# Altium project Non-Isolated Gate Driver and Supply.PrjPcb
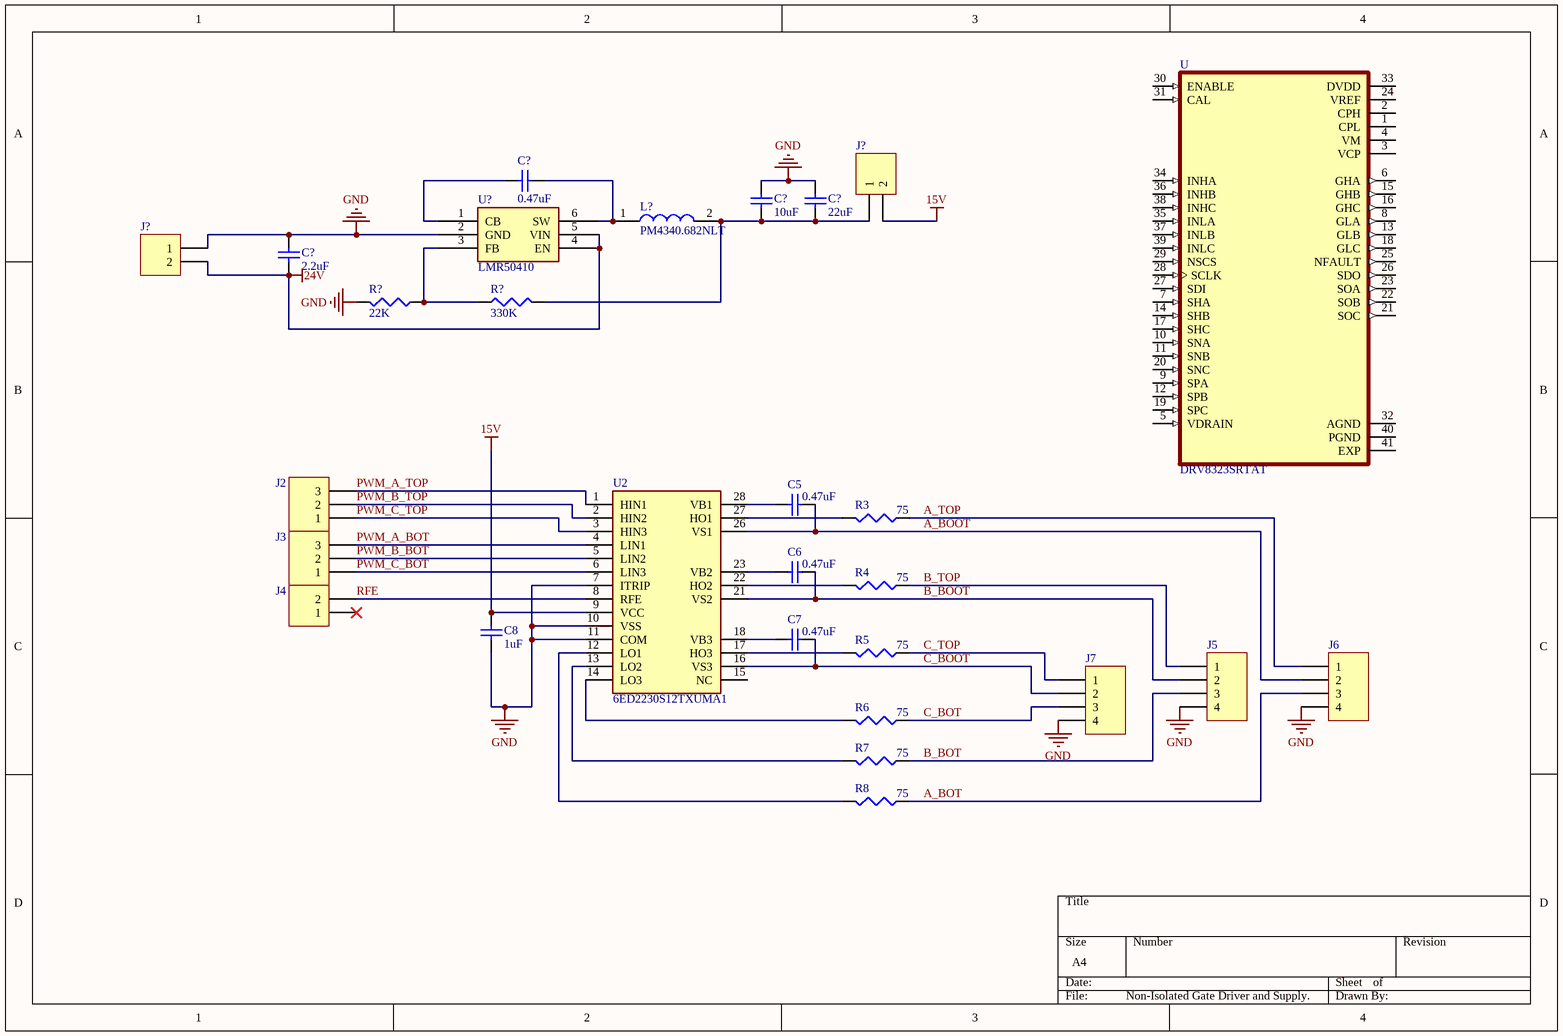
[diagram p0: Non-Isolated Gate Driver and Supply.SchDoc]
1 sheet, 28 parts. Net scope: global (net labels, ports and power ports of the same name join across sheets).
Board file: Non-Isolated Gate Driver and Supply.PcbDoc

## Sheet Non-Isolated Gate Driver and Supply.SchDoc
size A4

### Parts
(Parts that share a designator on the sheet are numbered #1, #2 ... from top to bottom, then left to right.)
C5  value 0.47uF  [C1206]  (hidden comment: Cap)
C6  value 0.47uF  [C1206]  (hidden comment: Cap)
C7  value 0.47uF  [C1206]  (hidden comment: Cap)
C8  value 1uF  [C0805]  (hidden comment: Cap)
C?#1  value 0.47uF  [C0805]  (hidden comment: Cap)
C?#2  value 10uF  [C0805]  (hidden comment: Cap)
C?#3  value 22uF  [C0805]  (hidden comment: Cap)
C?#4  value 2.2uF  [C0805]  (hidden comment: Cap)
J2  Header 3  [HDR1X3]  (value not drawn)
J3  Header 3  [HDR1X3]  (value not drawn)
J4  Header 2  [HDR1X2]  (value not drawn)
J5  Header 4  [HDR1X4]  (value not drawn)
J6  Header 4  [HDR1X4]  (value not drawn)
J7  Header 4  [HDR1X4]  (value not drawn)
J?#1  Header 2  [HDR1X2]  (value not drawn)
J?#2  Header 2  [HDR1X2]  (value not drawn)
L?  PM4340.682NLT  [PM4340682NLT]
R3  value 75  [C1206]  (hidden comment: Res3)
R4  value 75  [C1206]  (hidden comment: Res3)
R5  value 75  [C1206]  (hidden comment: Res3)
R6  value 75  [C1206]  (hidden comment: Res3)
R7  value 75  [C1206]  (hidden comment: Res3)
R8  value 75  [C1206]  (hidden comment: Res3)
R?#1  value 330K  [J1-0603]  (hidden comment: Res3)
R?#2  value 22K  [J1-0603]  (hidden comment: Res3)
U  DRV8323SRTAT  [QFN50P600X600X80-41N415X415]
U2  6ED2230S12TXUMA1  [SOIC127P1030X265-28N]
U?  LMR50410  [LMR50410]

### Nets
15V: C8.1 J?#1.2 U2.9(VCC)
24V: C?#4.2 J?#2.2 U?.4(EN) U?.5(VIN)
GND: C8.2 C?#2.1 C?#3.1 C?#4.1 J5.4 J6.4 J7.4 J?#2.1 R?#2.2 U2.7(ITRIP) U2.10(VSS) U2.11(COM) U?.2(GND)
A_BOOT: C5.1 J6.2 U2.26(VS1)
A_BOT: J6.3 R8.1
A_TOP: J6.1 R3.1
B_BOOT: C6.1 J5.2 U2.21(VS2)
B_BOT: J5.3 R7.1
B_TOP: J5.1 R4.1
C_BOOT: C7.1 J7.2 U2.16(VS3)
C_BOT: J7.3 R6.1
C_TOP: J7.1 R5.1
PWM_A_BOT: J3.3 U2.4(LIN1)
PWM_A_TOP: J2.3 U2.1(HIN1)
PWM_B_BOT: J3.2 U2.5(LIN2)
PWM_B_TOP: J2.2 U2.2(HIN2)
PWM_C_BOT: J3.1 U2.6(LIN3)
PWM_C_TOP: J2.1 U2.3(HIN3)
RFE: J4.2 U2.8(RFE)
NetC5_2: C5.2 U2.28(VB1)
NetC6_2: C6.2 U2.23(VB2)
NetC7_2: C7.2 U2.18(VB3)
NetC?#1_1: C?#1.1 U?.1(CB)
NetC?#1_2: C?#1.2 L?.1 U?.6(SW)
NetC?#2_2: C?#2.2 C?#3.2 J?#1.1 L?.2 R?#1.2
NetR3_2: R3.2 U2.27(HO1)
NetR4_2: R4.2 U2.22(HO2)
NetR5_2: R5.2 U2.17(HO3)
NetR6_2: R6.2 U2.14(LO3)
NetR7_2: R7.2 U2.13(LO2)
NetR8_2: R8.2 U2.12(LO1)
NetR?#1_1: R?#1.1 R?#2.1 U?.3(FB)

Not connected (* = marked no-connect by the designer): J4 1*; U 1(CPL) 2(CPH) 3(VCP) 4(VM) 5(VDRAIN) 6(GHA) 7(SHA) 8(GLA) 9(SPA) 10(SNA) 11(SNB) 12(SPB) 13(GLB) 14(SHB) 15(GHB) 16(GHC) 17(SHC) 18(GLC) 19(SPC) 20(SNC) 21(SOC) 22(SOB) 23(SOA) 24(VREF) 25(NFAULT) 26(SDO) 27(SDI) 28(SCLK) 29(NSCS) 30(ENABLE) 31(CAL) 32(AGND) 33(DVDD) 34(INHA) 35(INLA) 36(INHB) 37(INLB) 38(INHC) 39(INLC) 40(PGND) 41(EXP); U2 15(NC)

### Library data of the parts
C5-C8 C?#1-C?#4 = Cap: Capacitor; Published: 8-Jun-2000; LatestRevisionDate: 17-Jul-2002; LatestRevisionNote: Re-released for DXP Platform.; PackageReference: RAD-0.3; Publisher: Altium Limited; PackageDescription: Radial Cap, Thru-Hole; 2 Leads; 0.3 in Pin Spacing
J2 J3 = Header 3: Header, 3-Pin; LatestRevisionDate: 17-Jul-2002; LatestRevisionNote: Re-released for DXP Platform.; Publisher: Altium Limited
J4 J?#1 J?#2 = Header 2: Header, 2-Pin; LatestRevisionDate: 17-Jul-2002; LatestRevisionNote: Re-released for DXP Platform.; Publisher: Altium Limited
J5-J7 = Header 4: Header, 4-Pin; LatestRevisionDate: 17-Jul-2002; LatestRevisionNote: Re-released for DXP Platform.; Publisher: Altium Limited
L? = PM4340.682NLT: Inductor; Manufacturer_Name: Pulse; Datasheet Link: https://eu.mouser.com/ProductDetail/Pulse-Electronics/PM4345682NLT?qs=OTrKUuiFdkYTz4rt1sdWWw%3D%3D; Height: 2mm; Manufacturer_Part_Number: PM4340.682NLT
R3-R8 R?#1 R?#2 = Res3: Resistor; Published: 8-Jun-2000; LatestRevisionDate: 29-May-2009; LatestRevisionNote: IPC-7351 Footprint Added.; PackageReference: J1-0603; Publisher: Altium Limited; PackageDescription: Chip Resistor
U = DRV8323SRTAT: Multiphase Motor Driver Power MOSFET SPI 40-WQFN _6x6_; MF: Texas Instruments; SnapEDA_Link: https://www.snapeda.com/parts/DRV8323SRTAT/Texas%20Instruments/view-part/1675025/?ref=snap; Price: None; MP: DRV8323SRTAT; Package: WQFN-40 Texas Instruments; Value: *; Availability: Unavailable
U2 = 6ED2230S12TXUMA1: Integrated Circuit; Manufacturer_Name: Infineon; Datasheet Link: https://www.arrow.com/en/products/6ed2230s12txuma1/infineon-technologies-ag; Height: 2.65mm; Manufacturer_Part_Number: 6ED2230S12TXUMA1; Arrow Part Number: 6ED2230S12TXUMA1; Arrow Price/Stock: https://www.arrow.com/en/products/6ed2230s12txuma1/infineon-technologies-ag; Mouser Part Number: 726-6ED2230S12TXUMA1; Mouser Price/Stock: https://www.mouser.co.uk/ProductDetail/Infineon-Technologies/6ED2230S12TXUMA1?qs=%252BEew9%252B0nqrDqONJq1%252BaRWQ%3D%3D
U? = LMR50410: 4V to 36V 1A, Buck Converter; Manufacturer: Texas Instruments; Manufacturer Part Number: LMR50410YQDBVRQ1; Datasheet: https://www.ti.com/lit/ds/symlink/lmr50410-q1.pdf; Supplier Part Number: LMR50410YQDBVRQ1CT-ND; Supplier: Digikey